# Altium schematic sheet LCD_big.SchDoc
size A4; SheetNumber: 2; SheetTotal: 13
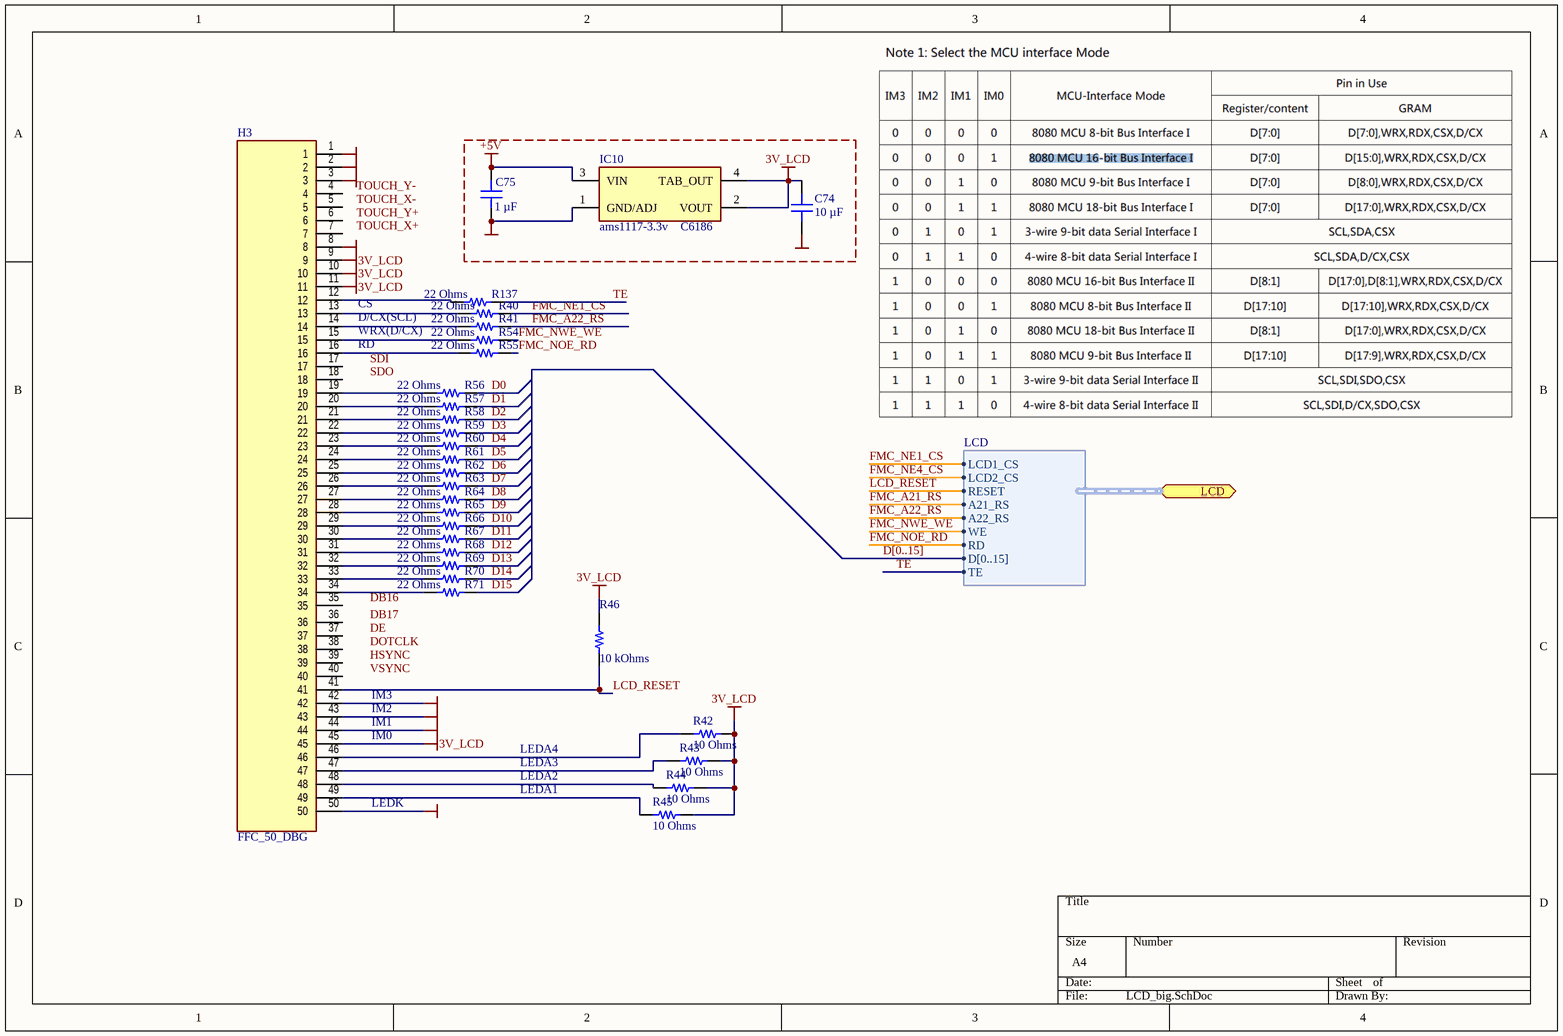
[diagram p0: LCD_big.SchDoc]

## Parts
C74  10 µF  [CAP 0805_2012]
C75  1 µF  [CAP 0805_2012]
H3  FFC_50_DBG  [FFC_50_DBG]
IC10  ams1117-3.3v  Supplier Part Number 1: C6186  [SOT-223]
R40  22 Ohms  [RES 0402_1005]
R41  22 Ohms  [RES 0402_1005]
R42  10 Ohms  [RES 0603_1608]
R43  10 Ohms  [RES 0603_1608]
R44  10 Ohms  [RES 0603_1608]
R45  10 Ohms  [RES 0603_1608]
R46  10 kOhms  [RES 0603_1608]
R54  22 Ohms  [RES 0402_1005]
R55  22 Ohms  [RES 0402_1005]
R56  22 Ohms  [RES 0402_1005]
R57  22 Ohms  [RES 0402_1005]
R58  22 Ohms  [RES 0402_1005]
R59  22 Ohms  [RES 0402_1005]
R60  22 Ohms  [RES 0402_1005]
R61  22 Ohms  [RES 0402_1005]
R62  22 Ohms  [RES 0402_1005]
R63  22 Ohms  [RES 0402_1005]
R64  22 Ohms  [RES 0402_1005]
R65  22 Ohms  [RES 0402_1005]
R66  22 Ohms  [RES 0402_1005]
R67  22 Ohms  [RES 0402_1005]
R68  22 Ohms  [RES 0402_1005]
R69  22 Ohms  [RES 0402_1005]
R70  22 Ohms  [RES 0402_1005]
R71  22 Ohms  [RES 0402_1005]
R137  22 Ohms  [RES 0402_1005]

## Ports
LCD (bidir, harness LCD)

## Harnesses
LCD: LCD1_CS, LCD2_CS, RESET, A21_RS, A22_RS, WE, RD, D[0..15], TE

## Nets
3V_LCD: C74.2 H3.9 H3.10 H3.11 H3.45 IC10.2(VOUT) IC10.4(TAB_OUT) R42.2 R43.2 R44.2 R45.2 R46.2
+5V: C75.2 IC10.3(VIN)
GND: C74.1 C75.1 H3.1 H3.2 H3.3 H3.8 H3.42 H3.43 H3.44 H3.50 IC10.1(GND/ADJ)
D0: R56.2
D1: R57.2
D2: R58.2
D3: R59.2
D4: R60.2
D5: R61.2
D6: R62.2
D7: R63.2
D8: R64.2
D9: R65.2
D10: R66.2
D11: R67.2
D12: R68.2
D13: R69.2
D14: R70.2
D15: R71.2
FMC_A21_RS: port LCD.A21_RS
FMC_A22_RS: R41.2 ; port LCD.A22_RS
FMC_NE1_CS: R40.2 ; port LCD.LCD1_CS
FMC_NE4_CS: port LCD.LCD2_CS
FMC_NOE_RD: R55.2 ; port LCD.RD
FMC_NWE_WE: R54.2 ; port LCD.WE
LCD_RESET: H3.41 R46.1 ; port LCD.RESET
TE: R137.2 ; port LCD.TE
NetH3_12: H3.12 R137.1
NetH3_13: H3.13 R40.1
NetH3_14: H3.14 R41.1
NetH3_15: H3.15 R54.1
NetH3_16: H3.16 R55.1
NetH3_19: H3.19 R56.1
NetH3_20: H3.20 R57.1
NetH3_21: H3.21 R58.1
NetH3_22: H3.22 R59.1
NetH3_23: H3.23 R60.1
NetH3_24: H3.24 R61.1
NetH3_25: H3.25 R62.1
NetH3_26: H3.26 R63.1
NetH3_27: H3.27 R64.1
NetH3_28: H3.28 R65.1
NetH3_29: H3.29 R66.1
NetH3_30: H3.30 R67.1
NetH3_31: H3.31 R68.1
NetH3_32: H3.32 R69.1
NetH3_33: H3.33 R70.1
NetH3_34: H3.34 R71.1
NetH3_46: H3.46 R42.1
NetH3_47: H3.47 R43.1
NetH3_48: H3.48 R44.1
NetH3_49: H3.49 R45.1

Not connected (* = marked no-connect by the designer): H3 4 5 6 7 17 18 35 36 37 38 39 40

## Buses and harness runs
bus D[0..15]

## Notes on the sheet
- (near H3) CS
- D/CX(SCL)
- WRX(D/CX)
- (near H3) RD
- IM2
- IM3
- IM0
- IM1
- LEDA2
- LEDA3
- LEDA4
- LEDK
- LEDA1
- Labels drawn without touching a wire or pin: DB16, DB17, DE, DOTCLK, HSYNC, SDI, SDO, TOUCH_X+, TOUCH_X-, TOUCH_Y+, TOUCH_Y-, VSYNC

## Library data of the parts
C74 = C0805C106K8PAC7800: CAP CER 10UF 10V X5R 0805; manufacturer: KEMET; Tolerance: ±10%; Part Number: C0805C106K8PAC7800; Value: 10 µF; Applications: Bypass, Decoupling; Capacitance: 10 µF; componentlink1description: Datasheet; componentlink1url: https://connect.kemet.com:7667/gateway/IntelliData-ComponentDocumentation/1.0/download/datasheet/C0805C106K8PACTU; componentlink2description: DigiKey Link; componentlink2url: https://www.digikey.com/en/products/detail/kemet/C0805C106K8PAC7800/1090830; Device Package: 0805 (2012 Metric); lastupdated: 9/14/2022 7:51:56 AM; Lifecycle Status: Active; Minimum Order: 1; Mounting Type: Surface Mount, MLCC; Operating Temperature: -55°C ~ 85°C; Package / Case: 0805 (2012 Metric); packaging: TapeAndReel; partid: 44790; Part Status: Active; price: 0.02; series: SMD Comm X5R; Size / Dimension: 0.079" L x 0.049" W (2.00mm x 1.25mm); Supplier 1: DigiKey; Supplier Part Number 1: 399-C0805C106K8PAC7800CT-ND; Temperature Coefficient: X5R; Thickness (Max): 0.055" (1.40mm); Voltage - Rated: 10V
C75 = C0805C105K4RAC7800: CAP CER 1UF 16V X7R 0805; manufacturer: KEMET; Tolerance: ±10%; Part Number: C0805C105K4RAC7800; Value: 1 µF; Applications: Bypass, Decoupling; Capacitance: 1 µF; componentlink1description: Datasheet; componentlink1url: https://api.kemet.com/component-edge/download/datasheet/C0805C105K4RACTU.pdf; componentlink2description: DigiKey Link; componentlink2url: https://www.digikey.com/en/products/detail/kemet/C0805C105K4RAC7800/416047; Device Package: 0805 (2012 Metric); lastupdated: 9/19/2022 1:03:30 PM; Lifecycle Status: Active; Minimum Order: 1; Mounting Type: Surface Mount, MLCC; Operating Temperature: -55°C ~ 125°C; Package / Case: 0805 (2012 Metric); packaging: TapeAndReel; partid: 32075; Part Status: Active; price: 0.01; series: SMD Comm X7R; Size / Dimension: 0.079" L x 0.049" W (2.00mm x 1.25mm); Supplier 1: DigiKey; Supplier Part Number 1: 399-C0805C105K4RAC7800CT-ND; Temperature Coefficient: X7R; Thickness (Max): 0.039" (1.00mm); Voltage - Rated: 16V
H3 = FFC_50_DBG: System: Connector
IC10 = ams1117-3.3v: Integrated Circuit; Manufacturer_Name: Advanced Monolithic Systems; Datasheet Link: http://www.advanced-monolithic.com/pdf/ds1117.pdf; Height: 1.8mm; Manufacturer_Part_Number: ams1117-3.3v; Supplier 1: LCSC
R40 R41 R54-R71 R137 = RMCF0402JT22R0: RES 22 OHM 5% 1/16W 0402; Manufacturer: Stackpole Electronics Inc; Power (Watts): 0.063W, 1/16W; Temperature Coefficient: ±100ppm/°C; Part Number: RMCF0402JT22R0; Value: 22 Ohms; ComponentLink1Description: Datasheet; ComponentLink1URL: https://www.seielect.com/catalog/sei-rmcf_rmcp.pdf; ComponentLink2Description: DigiKey Link; ComponentLink2URL: https://www.digikey.com/en/products/detail/stackpole-electronics-inc/RMCF0402JT22R0/1758165; Composition: Thick Film; Device Package: 0402 (1005 Metric); Features: Automotive AEC-Q200; Height - Seated (Max): 0.016" (0.40mm); LastUpdated: 2/9/2024 8:30:03 PM; Lifecycle Status: Active; Minimum Order: 1; Number of Terminations: 2; Operating Temperature: -55°C ~ 155°C; Package / Case: 0402 (1005 Metric); Packaging: CutTape; PartId: 7671; Part Status: Active; Price: 0.01; Resistance: 22 Ohms; Series: RMCF; Size / Dimension: 0.039" L x 0.020" W (1.00mm x 0.50mm); Supplier 1: DigiKey; Supplier Part Number 1: RMCF0402JT22R0CT-ND; Supplier Device Package: 0402; Tolerance: ±5%; Ratings: AEC-Q200
R42-R45 = ERJ-PA3F10R0V: RES SMD 10 OHM 1% 1/3W 0603; Manufacturer: Panasonic Electronic Components; Power (Watts): 0.333W, 1/3W; Temperature Coefficient: ±100ppm/°C; Part Number: ERJ-PA3F10R0V; Value: 10 Ohms; ComponentLink1Description: Datasheet; ComponentLink1URL: https://industrial.panasonic.com/cdbs/www-data/pdf/RDO0000/AOA0000C331.pdf; ComponentLink2Description: DigiKey Link; ComponentLink2URL: https://www.digikey.com/en/products/detail/panasonic-electronic-components/ERJ-PA3F10R0V/5035852; Composition: Thick Film; Device Package: 0603 (1608 Metric); Features: Automotive AEC-Q200, Pulse Withstanding; Height - Seated (Max): 0.022" (0.55mm); Lifecycle Status: Active; Minimum Order: 1; Number of Terminations: 2; Operating Temperature: -55°C ~ 155°C; Package / Case: 0603 (1608 Metric); Packaging: TapeAndReel; PartId: 5368; Part Status: Active; Price: 0.01; Ratings: AEC-Q200; Resistance: 10 Ohms; Series: ERJ-PA3; Size / Dimension: 0.063" L x 0.031" W (1.60mm x 0.80mm); Supplier 1: DigiKey; Supplier Part Number 1: P10.00BYCT-ND; Supplier Device Package: 0603; Tolerance: ±1%
  R42: LastUpdated: 2/9/2024 8:43:35 PM
  R43-R45: LastUpdated: 9/16/2023 7:33:50 PM
R46 = ERJ-3EKF1002V: RES SMD 10K OHM 1% 1/10W 0603; Manufacturer: Panasonic Electronic Components; Power (Watts): 0.1W, 1/10W; Temperature Coefficient: ±100ppm/°C; Part Number: ERJ-3EKF1002V; Value: 10 kOhms; ComponentLink1Description: Datasheet; ComponentLink1URL: https://industrial.panasonic.com/cdbs/www-data/pdf/RDA0000/AOA0000C304.pdf; ComponentLink2Description: DigiKey Link; ComponentLink2URL: https://www.digikey.com/en/products/detail/panasonic-electronic-components/ERJ-3EKF1002V/196066; Composition: Thick Film; Device Package: 0603 (1608 Metric); Height - Seated (Max): 0.022" (0.55mm); LastUpdated: 2/9/2024 8:41:59 PM; Lifecycle Status: Active; Minimum Order: 1; Number of Terminations: 2; Operating Temperature: -55°C ~ 155°C; Package / Case: 0603 (1608 Metric); Packaging: TapeAndReel; PartId: 25695; Part Status: Active; Price: 0.01; Resistance: 10 kOhms; Series: ERJ-3EK; Size / Dimension: 0.063" L x 0.031" W (1.60mm x 0.80mm); Supplier 1: DigiKey; Supplier Part Number 1: P10.0KHCT-ND; Supplier Device Package: 0603; Tolerance: ±1%; Features: Automotive AEC-Q200; Ratings: AEC-Q200